# EAGLE design sinduino (EAGLE 6.5.0)
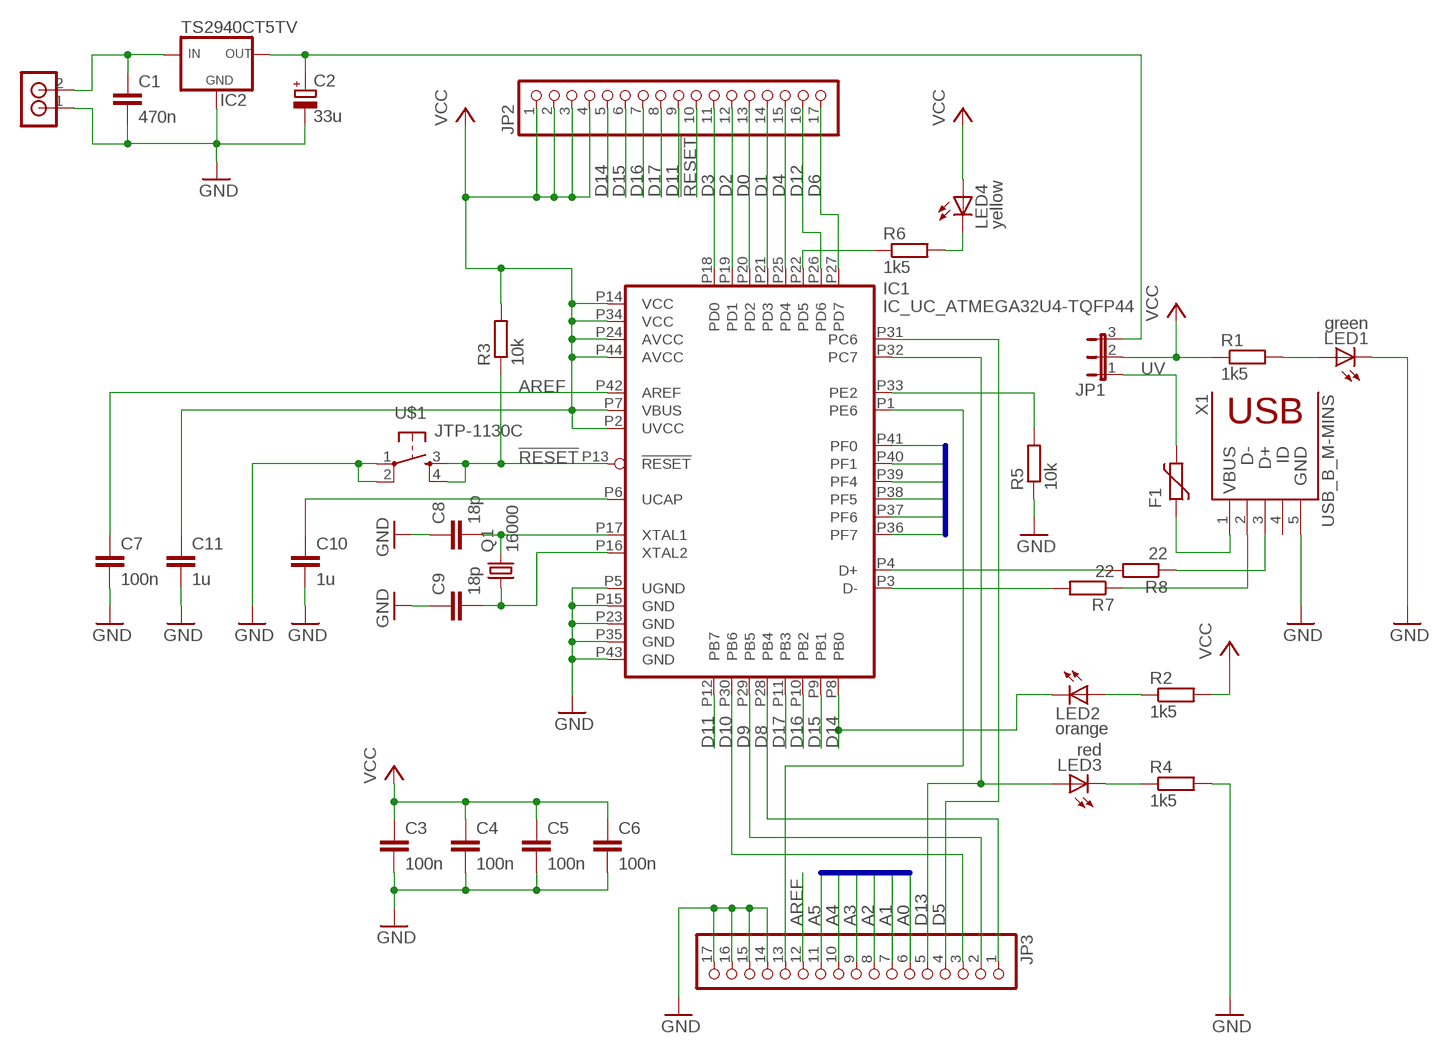
[diagram p0: schematic, sheet 1]

## Parts
C1  470n  C-EU025-025X050  [C025-025X050]
C2  33u  CPOL-EUE2.5-5  [E2,5-5]
C3  100n  C-EUC1206  [C1206]
C4  100n  C-EUC1206  [C1206]
C5  100n  C-EUC1206  [C1206]
C6  100n  C-EUC1206  [C1206]
C7  100n  C-EUC1206  [C1206]
C8  18p  C-EUC1206  [C1206]
C9  18p  C-EUC1206  [C1206]
C10  1u  C-EUC1206  [C1206]
C11  1u  C-EUC1206  [C1206]
F1  FUSE_PTC-1812  [PTC1812L]
IC1  IC_UC_ATMEGA32U4-TQFP44  [TQFP-44]
IC2  TS2940CT5TV  [TO220V]
JP1  JP2E  [JP2]
JP2  PINHD-1X17  [1X17]
JP3  PINHD-1X17  [1X17]
LED1  green  LED3MM  [LED3MM]
LED2  orange  LED3MM  [LED3MM]
LED3  red  LED3MM  [LED3MM]
LED4  yellow  LED3MM  [LED3MM]
Q1  16000  CRYSTALHC49U-V  [HC49U-V]
R1  1k5  R-EU_R1206  [R1206]
R2  1k5  R-EU_R1206  [R1206]
R3  10k  R-EU_R1206  [R1206]
R4  1k5  R-EU_R1206  [R1206]
R5  10k  R-EU_R1206  [R1206]
R6  1k5  R-EU_R1206  [R1206]
R7  22  R-EU_R1206  [R1206]
R8  22  R-EU_R1206  [R1206]
U$1  JTP-1130C  [JTP-1130]
U$3  RIACON_101_2  [RIACON_101_2]
X1  USB_B_M-MINS  [LUMBERG_2486-01]

## Nets
!RESET: IC1.P13(!RESET) JP2.10 R3.1 U$1.3(S) U$1.4(S1)
A0: IC1.P36(PF7) JP3.6
A1: IC1.P37(PF6) JP3.7
A2: IC1.P38(PF5) JP3.8
A3: IC1.P39(PF4) JP3.9
A4: IC1.P40(PF1) JP3.10
A5: IC1.P41(PF0) JP3.11
AREF: C7.1 IC1.P42(AREF) JP3.12
D0: IC1.P20(PD2) JP2.13
D1: IC1.P21(PD3) JP2.14
D2: IC1.P19(PD1) JP2.12
D3: IC1.P18(PD0) JP2.11
D4: IC1.P25(PD4) JP2.15
D5: IC1.P31(PC6) JP3.4
D6: IC1.P27(PD7) JP2.17
D7: IC1.P1(PE6) JP3.13
D8: IC1.P28(PB4) JP3.1
D9: IC1.P29(PB5) JP3.2
D10: IC1.P30(PB6) JP3.3
D11: IC1.P12(PB7) JP2.9
D12: IC1.P26(PD6) JP2.16
D13: IC1.P32(PC7) JP3.5 LED3.A
D14: IC1.P8(PB0) JP2.5 LED2.K(C)
D15: IC1.P9(PB1) JP2.6
D16: IC1.P10(PB2) JP2.7
D17: IC1.P11(PB3) JP2.8
D+: IC1.P4(D+) R8.2
D-: IC1.P3(D-) R7.2
GND [supply]: C1.2 C2.- C3.2 C4.2 C5.2 C6.2 C7.2 C8.1 C9.1 C10.2 C11.2 IC1.P5(UGND) IC1.P15(GND) IC1.P23(GND) IC1.P35(GND) IC1.P43(GND) IC2.2(GND) JP3.14 JP3.15 JP3.16 JP3.17 LED1.K(C) R4.2 R5.1 U$1.1(P) U$1.2(P1) U$3.1 X1.5
HWB: IC1.P33(PE2) R5.2
N$5: R7.1 X1.2
N$7: R8.1 X1.3
N$10 [supply]: F1.1 X1.1
N$11: LED4.K(C) R6.2
N$14: LED1.A R1.2
N$15 [supply]: C1.1 IC2.1(IN) U$3.2
N$16 [supply]: C2.+ IC2.3(OUT) JP1.3
N$17: LED2.A R2.1
N$18: LED3.K(C) R4.1
TXLED: IC1.P22(PD5) R6.1
UCAP: C10.1 IC1.P6(UCAP)
UV [supply]: F1.2 JP1.1
VCC [supply]: C3.1 C4.1 C5.1 C6.1 C11.1 IC1.P2(UVCC) IC1.P7(VBUS) IC1.P14(VCC) IC1.P24(AVCC) IC1.P34(VCC) IC1.P44(AVCC) JP1.2 JP2.1 JP2.2 JP2.3 JP2.4 LED4.A R1.1 R2.2 R3.2
XTAL1: C8.2 IC1.P17(XTAL1) Q1.2
XTAL2: C9.2 IC1.P16(XTAL2) Q1.1
Unconnected: X1.4

## Buses
A[0..5]

## Library data of the parts
C1 C3-C11 = rcl:C-EU: CAPACITOR, European symbol
C2 = rcl:CPOL-EU: POLARIZED CAPACITOR, European symbol
F1 = dp_devices:FUSE_PTC: Resettable PTC
IC1 = dp_devices:IC_UC_ATMEGA32U4
IC2 = n39:TS2940: 1A Ultra Low Dropout Fixed Positive Voltage Regulator; REICHELT: LM 2940 CT5
JP1 = jumper:JP2E: JUMPER
JP2 JP3 = pinhead:PINHD-1X17: PIN HEADER
LED1-LED4 = led:LED: LED OSRAM: - CHIPLED LG R971, LG N971, LY N971, LG Q971, LY Q971, LO R971, LY R971 LH N974, LH R974 LS Q976, LO Q976, LY Q976 LO Q996 - Hyper CHIPLED LW Q18S LB Q993, LB Q99A, LB R99A - SideLED LS A670, LO A670, LY A670, LG A670, LP A670 LB A673, LV A673, LT A673, LW A673 LH A674 LY A675 LS A676, LA A676, LO A676, LY A676, LW A676 LS A679, LY A679, LG A679 - Hyper Micro SIDELED® LS Y876, LA Y876, LO Y876, LY Y876 LT Y87S - SmartLED LW L88C, LW L88S LB L89C, LB L89S, LG L890 LS L89K, LO L89K, LY L89K LS L896, LA L896, LO L896, LY L896 - TOPLED LS T670, LO T670, LY T670, LG T670, LP T670 LSG T670, LSP T670, LSY T670, LOP T670, LYG T670 LG T671, LOG T671, LSG T671 LB T673, LV T673, LT T673, LW T673 LH T674 LS T676, LA T676, LO T676, LY T676, LB T676, LH T676, LSB T676, LW T676 LB T67C, LV T67C, LT T67C, LS T67K, LO T67K, LY T67K, LW E67C LS E67B, LA E67B, LO E67B, LY E67B, LB E67C, LV E67C, LT E67C LW T67C LS T679, LY T679, LG T679 LS T770, LO T770, LY T770, LG T770, LP T770 LB T773, LV T773, LT T773, LW T773 LH T774 LS E675, LA E675, LY E675, LS T675 LS T776, LA T776, LO T776, LY T776, LB T776 LHGB T686 LT T68C, LB T68C - Hyper Mini TOPLED® LB M676 - Mini TOPLED Santana® LG M470 LS M47K, LO M47K, LY M47K Source: http://www.osram.convergy.de LUXEON: - LUMILED® LXK2-PW12-R00, LXK2-PW12-S00, LXK2-PW14-U00, LXK2-PW14-V00 LXK2-PM12-R00, LXK2-PM12-S00, LXK2-PM14-U00 LXK2-PE12-Q00, LXK2-PE12-R00, LXK2-PE12-S00, LXK2-PE14-T00, LXK2-PE14-U00 LXK2-PB12-K00, LXK2-PB12-L00, LXK2-PB12-M00, LXK2-PB14-N00, LXK2-PB14-P00, LXK2-PB14-Q00 LXK2-PR12-L00, LXK2-PR12-M00, LXK2-PR14-Q00, LXK2-PR14-R00 LXK2-PD12-Q00, LXK2-PD12-R00, LXK2-PD12-S00 LXK2-PH12-R00, LXK2-PH12-S00 LXK2-PL12-P00, LXK2-PL12-Q00, LXK2-PL12-R00 Source: www.luxeon.com KINGBRIGHT: KA-3528ASYC Source: www.kingbright.com
Q1 = crystal:CRYSTAL: CRYSTAL; OC_FARNELL: 1666969; OC_NEWARK: unknown
R1-R8 = rcl:R-EU_: RESISTOR, European symbol
U$1 = n39:JTP-1130: Kurzhubtaster 6x6mm, Höhe: 8,0mm, 12V, vertikal TASTER 9305 <http://www.reichelt.de/?ARTICLE=44586>; REICHELT: TASTER 9305
U$3 = n39:RIACON_101_2: RIACON Anschlussklemme (AKL) Typ 101 Rastermaß 5,08 mm; REICHELT: AKL 101-02
X1 = n39:USB_B_M: USB 1.x and 2.x series "B" mini or micro plug; REICHELT: LUM 2486-01

## Net classes
0 default: width 0.305 mm
1 supply: width 0.406 mm

## Board
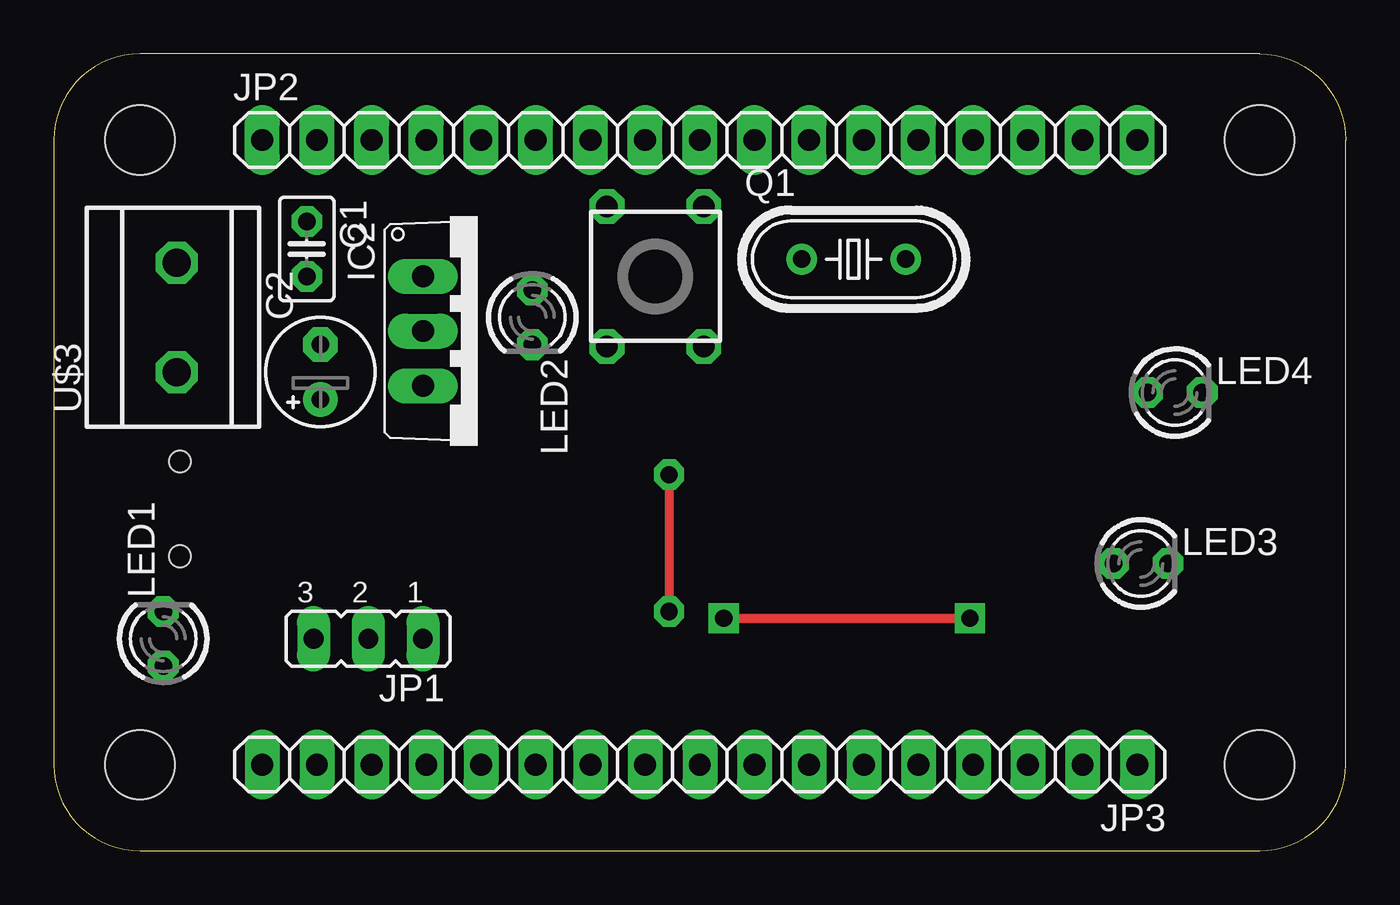
[diagram p1: board, top side]
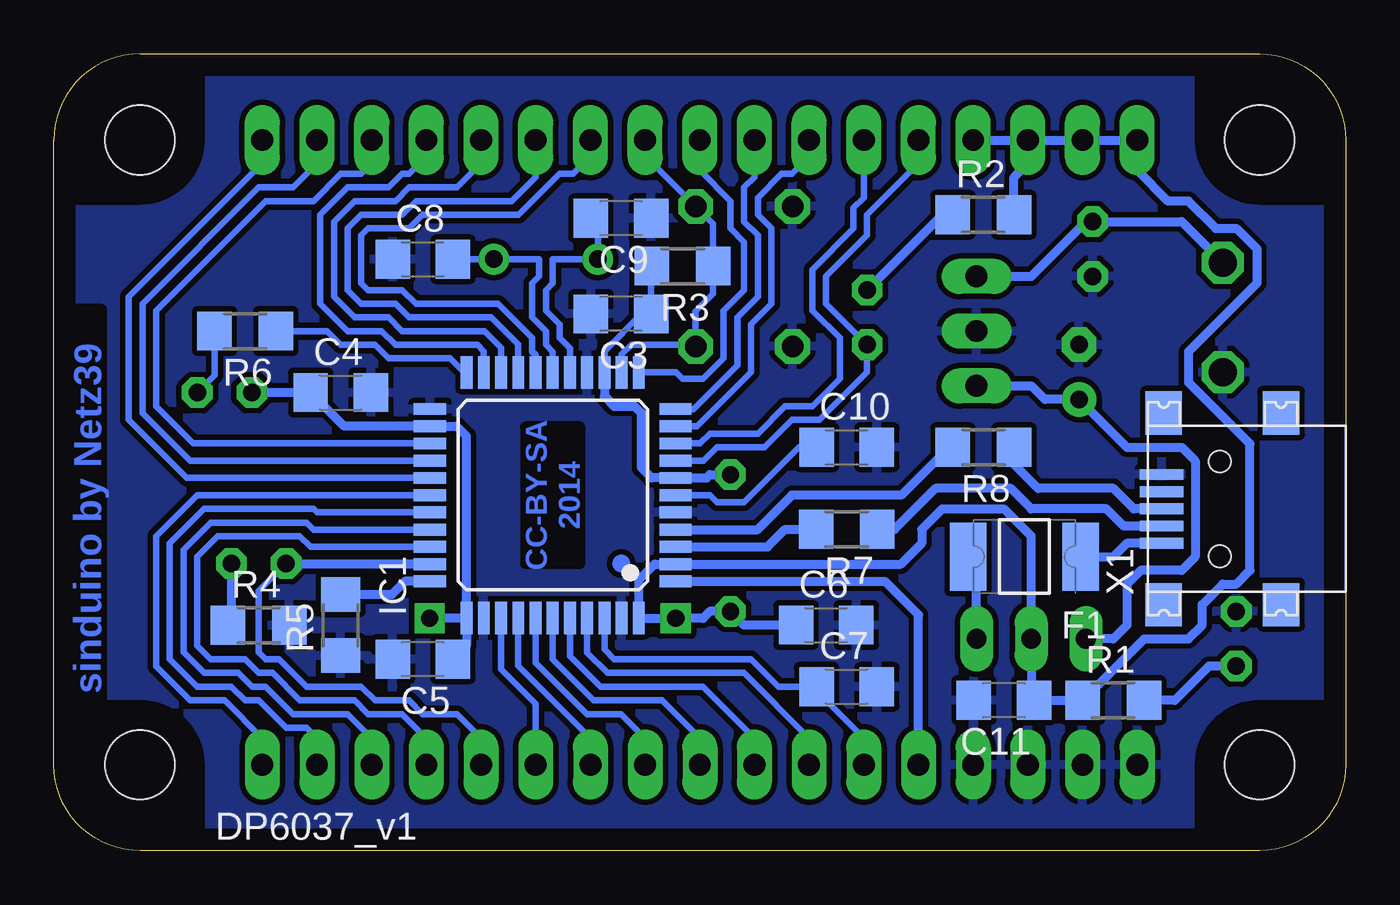
[diagram p2: board, bottom side, seen from below]

Size 60 x 37 mm. Coordinates in mm from the lower left corner, seen from the top.
Copper layers (1*16): Top 0.035mm / dielectric 1.5mm / Bottom 0.035mm
Design rules "default *": minimum track width 10mil, minimum drill 0.8mm, track to track 10mil, track to pad 10mil, pad to pad 10mil, via to via 10mil, smd to smd 8mil, copper to edge 40mil, drill to drill 8mil, minimum pad ring 12mil, minimum via ring 12mil, stop-mask expansion 4mil, vias tented up to drill 0mil, thermal gap 10mil

### Footprints (pad centres in the part's own frame; a part is rotated, then mirrored left to right if it is on the bottom)
C025-025X050 = drill 0.813 octagon: 1 -1.27,0; 2 1.27,0
E2,5-5 = drill 0.813 pad 1.6: + -1.27,0 | drill 0.813 pad 1.6 octagon: - 1.27,0
C1206 = smd 1.6 x 1.8: 1 -1.4,0; 2 1.4,0
PTC1812L = smd 1.7 x 3.15: 1 -2.62,0; 2 2.62,0
TQFP-44 = smd 0.55 x 1.5: P1 -4,-5.7; P2 -3.2,-5.7; P3 -2.4,-5.7; P4 -1.6,-5.7; P5 -0.8,-5.7; P6 0,-5.7; P7 0.8,-5.7; P8 1.6,-5.7; P9 2.4,-5.7; P10 3.2,-5.7; P11 4,-5.7; P23 4,5.7; P24 3.2,5.7; P25 2.4,5.7; P26 1.6,5.7; P27 0.8,5.7; P28 0,5.7; P29 -0.8,5.7; P30 -1.6,5.7; P31 -2.4,5.7; P32 -3.2,5.7; P33 -4,5.7 | smd 1.5 x 0.55: P12 5.7,-4; P13 5.7,-3.2; P14 5.7,-2.4; P15 5.7,-1.6; P16 5.7,-0.8; P17 5.7,0; P18 5.7,0.8; P19 5.7,1.6; P20 5.7,2.4; P21 5.7,3.2; P22 5.7,4; P34 -5.7,4; P35 -5.7,3.2; P36 -5.7,2.4; P37 -5.7,1.6; P38 -5.7,0.8; P39 -5.7,0; P40 -5.7,-0.8; P41 -5.7,-1.6; P42 -5.7,-2.4; P43 -5.7,-3.2; P44 -5.7,-4
TO220V = drill 1.016 long: 1 -2.54,-2.54; 2 0,-2.54; 3 2.54,-2.54
JP2 = drill 0.914 long: 1 -2.54,0; 2 0,0; 3 2.54,0
1X17 = drill 1.016 long: 1 -20.32,0; 2 -17.78,0; 3 -15.24,0; 4 -12.7,0; 5 -10.16,0; 6 -7.62,0; 7 -5.08,0; 8 -2.54,0; 9 0,0; 10 2.54,0; 11 5.08,0; 12 7.62,0; 13 10.16,0; 14 12.7,0; 15 15.24,0; 16 17.78,0; 17 20.32,0
LED3MM = drill 0.813 octagon: A -1.27,0; K 1.27,0
HC49U-V = drill 0.813: 1 -2.413,0; 2 2.413,0
R1206 = smd 1.6 x 1.803: 1 -1.422,0; 2 1.422,0
JTP-1130 = drill 1 octagon: 1 3.25,-2.25; 2 -3.25,-2.25; 3 3.25,2.25; 4 -3.25,2.25
DP6037_V1 = hole 3.2: 4,4; 56,4; 56,33; 4,33
RIACON_101_2 = drill 1.3 octagon: 1 -2.54,0; 2 2.54,0
LUMBERG_2486-01 = smd 0.5 x 2: 1 -1.6,2.7; 2 -0.8,2.7; 3 0,2.7; 4 0.8,2.7; 5 1.6,2.7 | smd 2 x 1.7: P$1 4.45,2.6; P$2 4.45,-2.85; P$3 -4.45,-2.85; P$4 -4.45,2.6 | hole 1: 2.2,0; -2.2,0

### Placement (x,y rotation side)
C1  11.75,27.94 270 top
C2  12.38,22.23 90 top
C3  33.66,24.92 180 bottom
C4  46.67,21.27 0 bottom
C5  42.86,8.89 180 bottom
C6  24.13,10.48 0 bottom
C7  23.18,7.62 0 bottom
C8  22p  [C1206]  42.86,27.46 0 bottom
C9  22p  [C1206]  33.66,29.37 180 bottom
C10  23.18,18.73 0 bottom
C11  15.88,6.99 180 bottom
F1  14.92,13.65 180 bottom
IC1  36.83,16.51 90 bottom
IC2  19.68,24.13 270 top
JP1  14.61,9.84 180 top
JP2  30,33 0 top
JP3  30,4 180 top
LED1  5.08,9.84 90 top
LED2  22.23,24.77 270 top
LED3  50.48,13.34 0 top
LED4  52.07,21.27 0 top
Q1  37.15,27.46 0 top
R1  10.79,6.99 0 bottom
R2  16.83,29.53 0 bottom
R3  30.8,27.15 180 bottom
R4  50.48,10.48 0 bottom
R5  46.67,10.48 90 bottom
R6  51.12,24.13 180 bottom
R7  23.18,14.92 180 bottom
R8  16.83,18.73 180 bottom
U$1  27.94,26.67 270 top
U$2  [DP6037_V1]  0,0 0 top
U$3  5.71,24.77 90 top
X1  5.85,15.88 90 bottom

### Tracks (layer width: path | path; a pad name or v marks a point on that pad's centre or on a via)
!RESET
  Bottom 0.305: 32.54,32.54 JP2.10 32.54,32.27 U$1.4 29.38,29.11 R3.1 29.38,25.87 30.19,25.05 U$1.3 30.27,23.5 33.18,23.5 33.63,23.04 IC1.P13
A0
  Bottom 0.305: IC1.P36 39.23,8.43 37.62,6.82 JP3.6
A1
  Bottom 0.305: IC1.P37 38.43,8.59 35.08,5.24 JP3.7
A2
  Bottom 0.305: JP3.8 32.54,5.24 33.66,6.35 35.24,6.35 37.63,8.74 IC1.P38
A3
  Bottom 0.305: JP3.9 30,5.24 31.75,6.99 34.92,6.99 36.83,8.89 IC1.P39
A4
  Bottom 0.305: JP3.10 27.46,5.24 29.84,7.62 34.61,7.62 36.03,9.04 IC1.P40
A5
  Bottom 0.305: JP3.11 24.92,5.24 27.94,8.26 34.29,8.26 35.23,9.2 IC1.P41
AREF
  Bottom 0.305: JP3.12 22.38,5.24 24.58,7.43 C7.1 26.35,7.62 27.62,8.89 33.97,8.89 34.43,9.35 IC1.P42
D0
  Bottom 0.305: JP2.13 40.16,31.91 41.27,30.8 43.5,30.8 44.13,30.16 46.04,30.16 46.99,29.21 46.99,25.72 46.04,24.77 44.45,24.77 43.81,24.13 40.01,24.13 39.23,23.36 IC1.P20
D1
  Bottom 0.305: JP2.14 42.7,32.23 43.5,31.43 43.81,31.43 44.45,30.8 46.35,30.8 47.62,29.53 47.62,25.4 46.35,24.13 44.77,24.13 44.13,23.5 40.32,23.5 40.03,23.2 IC1.P21
D2
  Bottom 0.305: JP2.12 37.62,31.28 38.73,30.16 43.18,30.16 43.81,29.53 45.72,29.53 46.35,28.89 46.35,26.04 45.72,25.4 44.13,25.4 43.5,24.77 39.69,24.77 38.43,23.51 IC1.P19
D3
  Bottom 0.305: JP2.11 35.08,32.23 35.88,31.43 36.51,31.43 38.42,29.53 42.86,29.53 43.5,28.89 45.4,28.89 45.72,28.57 45.72,26.35 45.4,26.04 43.81,26.04 43.18,25.4 39.37,25.4 37.78,23.81 37.78,23.18 37.63,23.02 IC1.P18
D4
  Bottom 0.305: JP2.15 45.24,31.91 45.72,31.43 46.67,31.43 47.94,30.16 50.16,30.16 55.24,25.08 55.24,20.64 53.52,18.91 IC1.P25
D5
  Bottom 0.305: JP3.4 42.7,5.24 43.81,6.35 45.4,6.35 46.04,6.99 48.58,6.99 49.85,8.26 50.48,8.26 51.12,8.89 52.7,8.89 53.34,9.53 53.34,13.65 52.39,14.61 48.58,14.61 48.08,14.11 IC1.P31
D6
  Bottom 0.305: JP2.17 50.32,31.91 56.52,25.72 56.52,20 53.82,17.31 IC1.P27
D7
  Bottom 0.406: JP3.13 19.84,10.95 21.4,12.51 IC1.P1
D8
  Bottom 0.305: JP3.1 50.32,5.24 52.07,6.99 53.66,6.99 55.24,8.57 55.24,14.61 53.34,16.51 IC1.P28
D9
  Bottom 0.305: JP3.2 47.78,5.24 48.26,5.71 49.21,5.71 50.48,6.99 51.12,6.99 51.75,7.62 53.34,7.62 54.61,8.89 54.61,14.29 53.02,15.88 47.94,15.88 47.78,15.71 IC1.P29
D10
  Bottom 0.305: JP3.3 45.24,5.24 46.35,6.35 48.9,6.35 50.16,7.62 50.8,7.62 51.44,8.26 53.02,8.26 53.98,9.21 53.98,13.97 52.7,15.24 48.26,15.24 47.93,14.91 IC1.P30
D11
  Bottom 0.305: JP2.9 30,31.59 28.57,30.16 28.57,28.89 27.94,28.26 27.94,26.04 28.89,25.08 28.89,22.86 29.84,21.91 30.8,21.91 31.1,22.21 IC1.P12
D12
  Bottom 0.305: JP2.16 47.78,31.91 48.9,30.8 50.48,30.8 55.88,25.4 55.88,20.32 53.67,18.11 IC1.P26
D13
  Bottom 0.305: JP3.5 40.16,5.24 41.27,6.35 42.86,6.35 43.5,6.99 45.09,6.99 45.72,7.62 48.26,7.62 49.53,8.89 50.16,8.89 50.48,9.21 50.48,12.06 LED3.A
  Bottom 0.406: IC1.P32 49.19,13.31 LED3.A
D14
  Bottom 0.305: JP2.5 19.84,31.91 22.23,29.53 22.23,28.57 24.13,26.67 24.13,25.4 LED2.K 22.23,22.23 24.45,20 25.72,20 26.99,18.73 29.21,18.73 29.83,18.11 IC1.P8
D15
  Bottom 0.305: JP2.6 22.38,30.32 22.86,29.84 22.86,28.89 24.77,26.99 24.77,25.08 23.5,23.81 23.5,21.91 24.77,20.64 26.04,20.64 27.3,19.37 29.53,19.37 29.98,18.91 IC1.P9
D16
  Bottom 0.305: JP2.7 24.92,32.23 25.72,31.43 26.19,31.43 27.3,30.32 27.3,29.53 26.67,28.89 26.67,25.4 27.62,24.45 27.62,22.23 30.14,19.71 IC1.P10
D17
  Bottom 0.305: JP2.8 27.46,31.28 27.94,30.8 27.94,29.21 27.3,28.57 27.3,25.72 28.26,24.77 28.26,22.54 30.29,20.51 IC1.P11
D+
  Bottom 0.406: R8.2 18.41,18.73 20.64,16.51 25.72,16.51 27.32,14.91 IC1.P4
D-
  Bottom 0.406: IC1.P3 26.85,14.11 26.04,14.92 R7.2
GND
  pour Bottom: 4,0 56,0 arc90 60,4 60,33 arc90 56,37 4,37 arc90 0,33 0,4 arc90
HWB
  Bottom 0.406: IC1.P33 43.69,12.51 44.3,11.9 R5.2
N$5
  Bottom 0.406: R7.1 20.95,14.92 19.05,16.83 15.56,16.83 14.61,15.88 11.11,15.88 10.31,15.07 X1.2
N$7
  Bottom 0.406: R8.1 15.4,17.95 14.29,16.83 10.79,16.83 9.84,15.88 X1.3
N$10
  Bottom 0.406: X1.1 10.17,14.28 10.79,13.65 F1.1
N$11
  Bottom 0.305: R6.2 52.54,22.07 LED4.K
N$14
  Bottom 0.406: LED1.A 6.35,8.57 7.94,6.99 R1.2
N$15
  Bottom 0.406: U$3.2 7.62,29.21 C1.1 12.06,29.21 14.61,26.67 IC2.1
N$16
  Bottom 0.406: IC2.3 14.61,21.59 13.97,20.95 C2.+ 10.16,18.73 7.62,18.73 6.99,18.1 6.99,13.65 7.62,13.02 9.53,13.02 10.16,12.38 10.16,10.48 10.79,9.84 JP1.3
N$17
  Bottom 0.406: LED2.A 18.73,29.53 R2.1
N$18
  Bottom 0.406: LED3.K 51.75,10.63 R4.1
TXLED
  Bottom 0.305: IC1.P22 40.94,22.21 41.59,22.86 44.45,22.86 45.09,23.5 46.67,23.5 47.31,24.13 R6.1
UCAP
  Bottom 0.305: IC1.P6 29.53,16.51 29.21,16.19 27.94,16.19 25.4,18.73 C10.1
UV
  Bottom 0.406: JP1.1 17.14,12.38 17.54,12.78 F1.2
VCC  (via drill 0.8)
  Top 0.406: v31.11,10.79 v42.55,10.79 | v28.57,17.46 v28.57,11.11
  Bottom 0.305: IC1.P14 34.43,23.2 32.7,24.92 C3.1 32.26,27.11 R3.2
  Bottom 0.406: JP2.4 JP2.3 | JP2.3 JP2.2 JP2.1 9.68,31.59 8.26,30.16 7.3,30.16 6.03,28.89 5.08,28.89 4.13,27.94 4.13,26.35 7.3,23.18 7.3,21.75 4.45,18.89 4.45,13.02 5.08,12.38 5.71,12.38 6.67,11.43 6.67,10.48 7.3,9.84 9.36,9.84 R1.1 C11.1 14.61,7.12 JP1.2 14.61,14.61 15.88,15.88 18.73,15.88 19.68,14.92 19.68,14.29 20.66,13.31 IC1.P2 32.09,13.31 32.83,12.57 IC1.P44 32.81,10.79 v31.11,10.79 29.84,10.79 29.53,11.11 v28.57,11.11 27.94,10.48 C6.1 25.86,10.81 | IC1.P34 40.83,19.24 41.3,19.71 IC1.P24 46.51,19.71 C4.1 LED4.A | IC1.P34 40.83,9.52 C5.1 | IC1.P14 34.43,21.09 33.97,20.64 33.02,20.64 32.7,20.32 32.7,17.78 32.23,17.31 IC1.P7 29.68,17.31 29.53,17.46 v28.57,17.46 | JP2.3 14.76,31.91 15.4,31.27 R2.2 | v42.55,10.79 42.53,10.81 IC1.P34
XTAL1
  Bottom 0.305: IC1.P17 36.83,23.18 37.15,23.5 37.15,24.13 37.78,24.77 37.78,26.35 37.47,26.67 37.47,27.46 Q1.2 C8.2
XTAL2
  Bottom 0.305: C9.2 34.73,29.05 Q1.1 36.83,27.46 36.83,26.35 37.15,26.04 37.15,25.08 36.51,24.45 36.51,23.81 36.03,23.33 IC1.P16
(copper drawn outside any net)
  shapes: Bottom circle x1

### Text on the board
Bottom: CC-BY-SA / 2014 | sinduino by Netz39